# Altium schematic sheet Sheet2.SchDoc
size A4
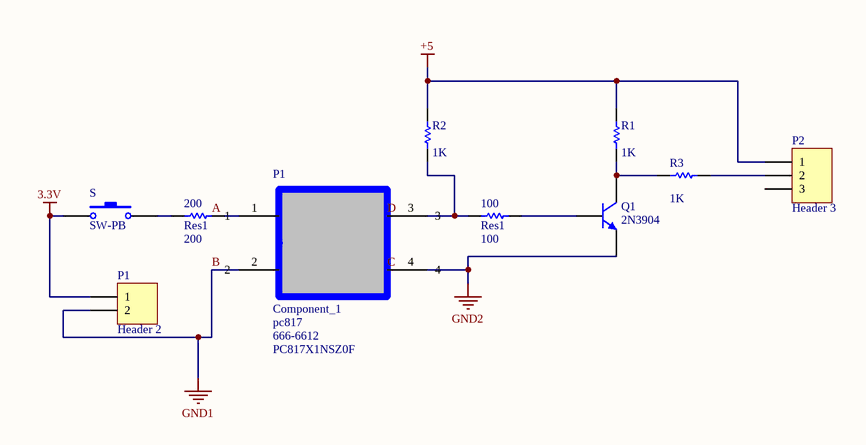
[diagram p0: Sheet2.SchDoc]

## Parts
(Parts that share a designator on the sheet are numbered #1, #2 ... from top to bottom, then left to right.)
100  Res1  value 100  [AXIAL-0.3]
200  Res1  value 200  [AXIAL-0.3]
P1#1  Component_1  part number: pc817  Supplier Part Number 1: 666-6612  Supplier Part Number 2: PC817X1NSZ0F  [PCBComponent_1]
P1#2  Header 2  [HDR1X2]
P2  Header 3  [HDR1X3]
Q1  2N3904  [TO-92A]
R1  value 1K  [AXIAL-0.3]
R2  value 1K  [AXIAL-0.3]
R3  value 1K  [AXIAL-0.3]
S  SW-PB  [SPST-2]

## Nets
3.3V: P1#2.1 S.1
+5: P2.1 R1.2 R2.2
B: P1#2.2  [also labelled GND1]
GND2: Q1.1(E)
C: P1#1.4
D: P1#1.3
Net100_1: 100.1 Q1.2(B)
Net100_2: 100.2 R2.1
Net200_2: 200.2 S.2
NetP2_2: P2.2 R3.1
NetQ1_3: Q1.3(C) R1.1 R3.2

Not connected (* = marked no-connect by the designer): 200 1; P1#1 1 2; P2 3

## Notes on the sheet
- Labels drawn without touching a wire or pin: A

## Library data of the parts
100 200 R1-R3 = Res1: Resistor; Published: 8-Jun-2000; LatestRevisionDate: 17-Jul-2002; LatestRevisionNote: Re-released for DXP Platform.; PackageReference: AXIAL-0.3; Publisher: Altium Limited; PackageDescription: Axial Device, Thru-Hole; 2 Leads; 0.3 in Pin Spacing
P1#2 = Header 2: Header, 2-Pin; LatestRevisionDate: 17-Jul-2002; LatestRevisionNote: Re-released for DXP Platform.; Publisher: Altium Limited
P2 = Header 3: Header, 3-Pin; LatestRevisionDate: 17-Jul-2002; LatestRevisionNote: Re-released for DXP Platform.; Publisher: Altium Limited
Q1 = 2N3904: NPN General Purpose Amplifier; Published: 8-Jun-2000; LatestRevisionDate: 15-Jan-2003; LatestRevisionNote: PCB Footprint 'BCY-W3/D4.7' replaced; DatasheetVersion: 1997; PackageVersion: Sep-1998; PackageReference: TO-92A; Publisher: Altium Limited; PackageDescription: TO, Flat Index; 3 In-Line, Axial Leads; Body Dia. 4.5mm; Leads 0.51 x 0.48 mm (max); ComponentLink1Description: Manufacturer Link; ComponentLink1URL: http://www.fairchildsemi.com/; ComponentLink2Description: Datasheet; ComponentLink2URL: http://www.fairchildsemi.com/ds/2N%2F2N3904.pdf
S = SW-PB: Switch; Published: 24-Mar-1999; LatestRevisionDate: 17-Jul-2002; LatestRevisionNote: Re-released for DXP Platform.; PackageReference: SPST-2; Publisher: Altium Limited; PackageDescription: Switch; 2 Leads
P1#1 = Component_1: Supplier 1: RSComponents; Supplier 2: Future Electronics